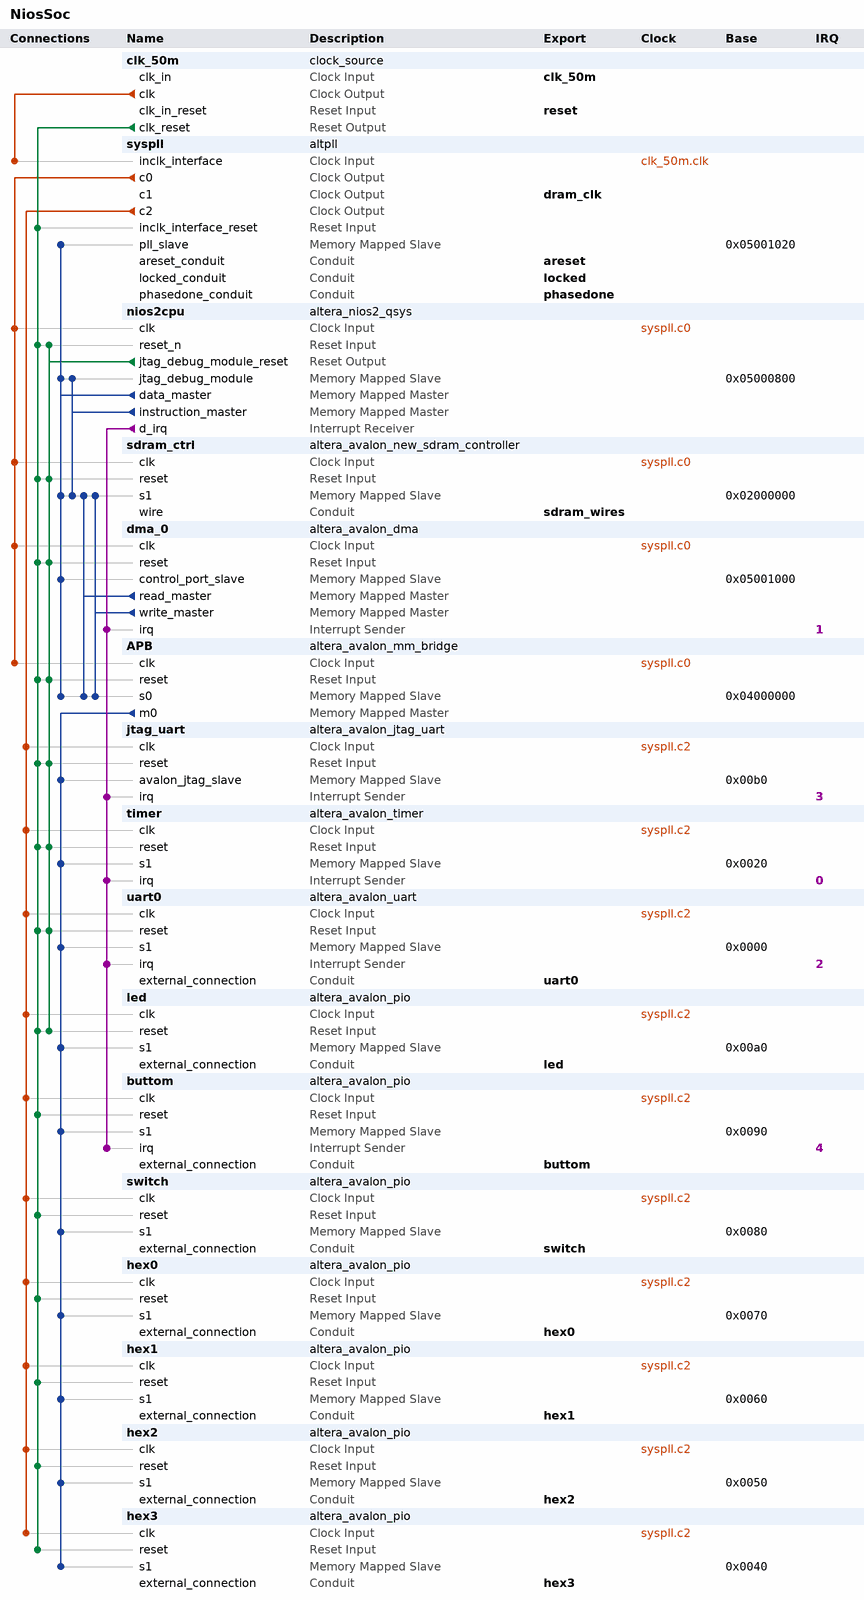
[diagram p0: system contents]
# Platform Designer (Qsys) system NiosSoc, Cyclone II EP2C70F896C6
# Parameters at their usual value, and those the tool derives, are not listed.
package require -exact qsys 13.0.1.99.2
create_system NiosSoc
set_project_property DEVICE_FAMILY {Cyclone II}
set_project_property DEVICE EP2C70F896C6

add_instance clk_50m clock_source 13.0
set_instance_parameter_value clk_50m clockFrequency 50000000

add_instance syspll altpll 13.0
set_instance_parameter_value syspll INCLK0_INPUT_FREQUENCY 20000
set_instance_parameter_value syspll GATE_LOCK_SIGNAL NO
set_instance_parameter_value syspll VALID_LOCK_MULTIPLIER 1
set_instance_parameter_value syspll INVALID_LOCK_MULTIPLIER 5
set_instance_parameter_value syspll CLK0_MULTIPLY_BY 2
set_instance_parameter_value syspll CLK1_MULTIPLY_BY 2
set_instance_parameter_value syspll CLK2_MULTIPLY_BY 1
set_instance_parameter_value syspll CLK0_DIVIDE_BY 1
set_instance_parameter_value syspll CLK1_DIVIDE_BY 1
set_instance_parameter_value syspll CLK2_DIVIDE_BY 5
set_instance_parameter_value syspll CLK1_PHASE_SHIFT -2500
set_instance_parameter_value syspll CLK2_PHASE_SHIFT 0
set_instance_parameter_value syspll CLK1_DUTY_CYCLE 50
set_instance_parameter_value syspll CLK2_DUTY_CYCLE 50
set_instance_parameter_value syspll PORT_clk1 PORT_USED
set_instance_parameter_value syspll PORT_clk2 PORT_USED
set_instance_parameter_value syspll PORT_clk3 PORT_UNUSED
set_instance_parameter_value syspll PORT_ARESET PORT_UNUSED
set_instance_parameter_value syspll PORT_LOCKED PORT_UNUSED

add_instance nios2cpu altera_nios2_qsys 13.0
set_instance_parameter_value nios2cpu resetSlave sdram_ctrl.s1
set_instance_parameter_value nios2cpu mmu_TLBMissExcSlave None
set_instance_parameter_value nios2cpu exceptionSlave sdram_ctrl.s1
set_instance_parameter_value nios2cpu breakSlave nios2cpu.jtag_debug_module
set_instance_parameter_value nios2cpu impl Fast
set_instance_parameter_value nios2cpu icache_size 4096

add_instance sdram_ctrl altera_avalon_new_sdram_controller 13.0.1.99.2
set_instance_parameter_value sdram_ctrl TAC 5.5
set_instance_parameter_value sdram_ctrl TRCD 20.0
set_instance_parameter_value sdram_ctrl TRP 20.0
set_instance_parameter_value sdram_ctrl casLatency 3
set_instance_parameter_value sdram_ctrl columnWidth 9
set_instance_parameter_value sdram_ctrl dataWidth 16
set_instance_parameter_value sdram_ctrl generateSimulationModel false
set_instance_parameter_value sdram_ctrl model single_Micron_MT48LC4M32B2_7_chip
set_instance_parameter_value sdram_ctrl numberOfBanks 4
set_instance_parameter_value sdram_ctrl numberOfChipSelects 1
set_instance_parameter_value sdram_ctrl powerUpDelay 200.0
set_instance_parameter_value sdram_ctrl refreshPeriod 7.8125
set_instance_parameter_value sdram_ctrl rowWidth 13

add_instance dma_0 altera_avalon_dma 13.0.1.99.2
set_instance_parameter_value dma_0 allowByteTransactions true
set_instance_parameter_value dma_0 allowDoubleWordTransactions true
set_instance_parameter_value dma_0 allowHalfWordTransactions true
set_instance_parameter_value dma_0 allowQuadWordTransactions true
set_instance_parameter_value dma_0 burstEnable true
set_instance_parameter_value dma_0 fifoDepth 32
set_instance_parameter_value dma_0 maxBurstSize 128
set_instance_parameter_value dma_0 minimumDmaTransactionRegisterWidth 13

add_instance APB altera_avalon_mm_bridge 13.0
set_instance_parameter_value APB DATA_WIDTH 32
set_instance_parameter_value APB ADDRESS_WIDTH 10
set_instance_parameter_value APB ADDRESS_UNITS SYMBOLS
set_instance_parameter_value APB MAX_PENDING_RESPONSES 4

add_instance jtag_uart altera_avalon_jtag_uart 13.0.1.99.2
set_instance_parameter_value jtag_uart simInteractiveOptions NO_INTERACTIVE_WINDOWS

add_instance timer altera_avalon_timer 13.0.1.99.2
set_instance_parameter_value timer period 1
set_instance_parameter_value timer periodUnits USEC

add_instance uart0 altera_avalon_uart 13.0.1.99.2
set_instance_parameter_value uart0 baud 115200
set_instance_parameter_value uart0 dataBits 8
set_instance_parameter_value uart0 fixedBaud true
set_instance_parameter_value uart0 parity NONE
set_instance_parameter_value uart0 stopBits 1

add_instance led altera_avalon_pio 13.0.1.99.2
set_instance_parameter_value led direction Output
set_instance_parameter_value led width 27

add_instance buttom altera_avalon_pio 13.0.1.99.2
set_instance_parameter_value buttom captureEdge true
set_instance_parameter_value buttom direction Input
set_instance_parameter_value buttom edgeType FALLING
set_instance_parameter_value buttom generateIRQ true
set_instance_parameter_value buttom irqType EDGE
set_instance_parameter_value buttom simDoTestBenchWiring true
set_instance_parameter_value buttom width 4

add_instance switch altera_avalon_pio 13.0.1.99.2
set_instance_parameter_value switch direction Input
set_instance_parameter_value switch width 18

add_instance hex0 altera_avalon_pio 13.0.1.99.2
set_instance_parameter_value hex0 direction Output
set_instance_parameter_value hex0 width 8

add_instance hex1 altera_avalon_pio 13.0.1.99.2
set_instance_parameter_value hex1 direction Output
set_instance_parameter_value hex1 width 8

add_instance hex2 altera_avalon_pio 13.0.1.99.2
set_instance_parameter_value hex2 direction Output
set_instance_parameter_value hex2 width 8

add_instance hex3 altera_avalon_pio 13.0.1.99.2
set_instance_parameter_value hex3 direction Output
set_instance_parameter_value hex3 width 8

# connections
add_connection clk_50m.clk syspll.inclk_interface clock
add_connection syspll.c0 APB.clk clock
add_connection syspll.c0 dma_0.clk clock
add_connection syspll.c0 nios2cpu.clk clock
add_connection syspll.c0 sdram_ctrl.clk clock
add_connection syspll.c2 buttom.clk clock
add_connection syspll.c2 hex0.clk clock
add_connection syspll.c2 hex1.clk clock
add_connection syspll.c2 hex2.clk clock
add_connection syspll.c2 hex3.clk clock
add_connection syspll.c2 jtag_uart.clk clock
add_connection syspll.c2 led.clk clock
add_connection syspll.c2 switch.clk clock
add_connection syspll.c2 timer.clk clock
add_connection syspll.c2 uart0.clk clock
add_connection clk_50m.clk_reset APB.reset reset
add_connection clk_50m.clk_reset buttom.reset reset
add_connection clk_50m.clk_reset dma_0.reset reset
add_connection clk_50m.clk_reset hex0.reset reset
add_connection clk_50m.clk_reset hex1.reset reset
add_connection clk_50m.clk_reset hex2.reset reset
add_connection clk_50m.clk_reset hex3.reset reset
add_connection clk_50m.clk_reset jtag_uart.reset reset
add_connection clk_50m.clk_reset led.reset reset
add_connection clk_50m.clk_reset nios2cpu.reset_n reset
add_connection clk_50m.clk_reset sdram_ctrl.reset reset
add_connection clk_50m.clk_reset switch.reset reset
add_connection clk_50m.clk_reset syspll.inclk_interface_reset reset
add_connection clk_50m.clk_reset timer.reset reset
add_connection clk_50m.clk_reset uart0.reset reset
add_connection nios2cpu.jtag_debug_module_reset APB.reset reset
add_connection nios2cpu.jtag_debug_module_reset dma_0.reset reset
add_connection nios2cpu.jtag_debug_module_reset jtag_uart.reset reset
add_connection nios2cpu.jtag_debug_module_reset led.reset reset
add_connection nios2cpu.jtag_debug_module_reset nios2cpu.reset_n reset
add_connection nios2cpu.jtag_debug_module_reset sdram_ctrl.reset reset
add_connection nios2cpu.jtag_debug_module_reset timer.reset reset
add_connection nios2cpu.jtag_debug_module_reset uart0.reset reset
add_connection APB.m0 buttom.s1 avalon
set_connection_parameter_value APB.m0/buttom.s1 baseAddress 0x0090
add_connection APB.m0 hex0.s1 avalon
set_connection_parameter_value APB.m0/hex0.s1 baseAddress 0x0070
add_connection APB.m0 hex1.s1 avalon
set_connection_parameter_value APB.m0/hex1.s1 baseAddress 0x0060
add_connection APB.m0 hex2.s1 avalon
set_connection_parameter_value APB.m0/hex2.s1 baseAddress 0x0050
add_connection APB.m0 hex3.s1 avalon
set_connection_parameter_value APB.m0/hex3.s1 baseAddress 0x0040
add_connection APB.m0 jtag_uart.avalon_jtag_slave avalon
set_connection_parameter_value APB.m0/jtag_uart.avalon_jtag_slave baseAddress 0x00b0
add_connection APB.m0 led.s1 avalon
set_connection_parameter_value APB.m0/led.s1 baseAddress 0x00a0
add_connection APB.m0 switch.s1 avalon
set_connection_parameter_value APB.m0/switch.s1 baseAddress 0x0080
add_connection APB.m0 timer.s1 avalon
set_connection_parameter_value APB.m0/timer.s1 baseAddress 0x0020
add_connection APB.m0 uart0.s1 avalon
set_connection_parameter_value APB.m0/uart0.s1 baseAddress 0x0000
add_connection dma_0.read_master APB.s0 avalon
set_connection_parameter_value dma_0.read_master/APB.s0 baseAddress 0x04000000
add_connection dma_0.read_master sdram_ctrl.s1 avalon
set_connection_parameter_value dma_0.read_master/sdram_ctrl.s1 baseAddress 0x02000000
add_connection dma_0.write_master APB.s0 avalon
set_connection_parameter_value dma_0.write_master/APB.s0 baseAddress 0x04000000
add_connection dma_0.write_master sdram_ctrl.s1 avalon
set_connection_parameter_value dma_0.write_master/sdram_ctrl.s1 baseAddress 0x02000000
add_connection nios2cpu.data_master APB.s0 avalon
set_connection_parameter_value nios2cpu.data_master/APB.s0 baseAddress 0x04000000
add_connection nios2cpu.data_master dma_0.control_port_slave avalon
set_connection_parameter_value nios2cpu.data_master/dma_0.control_port_slave baseAddress 0x05001000
add_connection nios2cpu.data_master nios2cpu.jtag_debug_module avalon
set_connection_parameter_value nios2cpu.data_master/nios2cpu.jtag_debug_module baseAddress 0x05000800
add_connection nios2cpu.data_master sdram_ctrl.s1 avalon
set_connection_parameter_value nios2cpu.data_master/sdram_ctrl.s1 baseAddress 0x02000000
add_connection nios2cpu.data_master syspll.pll_slave avalon
set_connection_parameter_value nios2cpu.data_master/syspll.pll_slave baseAddress 0x05001020
add_connection nios2cpu.instruction_master nios2cpu.jtag_debug_module avalon
set_connection_parameter_value nios2cpu.instruction_master/nios2cpu.jtag_debug_module baseAddress 0x05000800
add_connection nios2cpu.instruction_master sdram_ctrl.s1 avalon
set_connection_parameter_value nios2cpu.instruction_master/sdram_ctrl.s1 baseAddress 0x02000000
add_connection nios2cpu.d_irq buttom.irq interrupt
set_connection_parameter_value nios2cpu.d_irq/buttom.irq irqNumber 4
add_connection nios2cpu.d_irq dma_0.irq interrupt
set_connection_parameter_value nios2cpu.d_irq/dma_0.irq irqNumber 1
add_connection nios2cpu.d_irq jtag_uart.irq interrupt
set_connection_parameter_value nios2cpu.d_irq/jtag_uart.irq irqNumber 3
add_connection nios2cpu.d_irq timer.irq interrupt
set_connection_parameter_value nios2cpu.d_irq/timer.irq irqNumber 0
add_connection nios2cpu.d_irq uart0.irq interrupt
set_connection_parameter_value nios2cpu.d_irq/uart0.irq irqNumber 2

# exported interfaces
add_interface reset reset sink
set_interface_property reset EXPORT_OF clk_50m.clk_in_reset
add_interface clk_50m clock sink
set_interface_property clk_50m EXPORT_OF clk_50m.clk_in
add_interface sdram_wires conduit end
set_interface_property sdram_wires EXPORT_OF sdram_ctrl.wire
add_interface uart0 conduit end
set_interface_property uart0 EXPORT_OF uart0.external_connection
add_interface led conduit end
set_interface_property led EXPORT_OF led.external_connection
add_interface dram_clk clock source
set_interface_property dram_clk EXPORT_OF syspll.c1
add_interface locked conduit end
set_interface_property locked EXPORT_OF syspll.locked_conduit
add_interface areset conduit end
set_interface_property areset EXPORT_OF syspll.areset_conduit
add_interface phasedone conduit end
set_interface_property phasedone EXPORT_OF syspll.phasedone_conduit
add_interface buttom conduit end
set_interface_property buttom EXPORT_OF buttom.external_connection
add_interface switch conduit end
set_interface_property switch EXPORT_OF switch.external_connection
add_interface hex0 conduit end
set_interface_property hex0 EXPORT_OF hex0.external_connection
add_interface hex1 conduit end
set_interface_property hex1 EXPORT_OF hex1.external_connection
add_interface hex2 conduit end
set_interface_property hex2 EXPORT_OF hex2.external_connection
add_interface hex3 conduit end
set_interface_property hex3 EXPORT_OF hex3.external_connection

set_interconnect_requirement {$system} qsys_mm.clockCrossingAdapter HANDSHAKE
set_interconnect_requirement {$system} qsys_mm.maxAdditionalLatency 1

save_system NiosSoc.qsys
